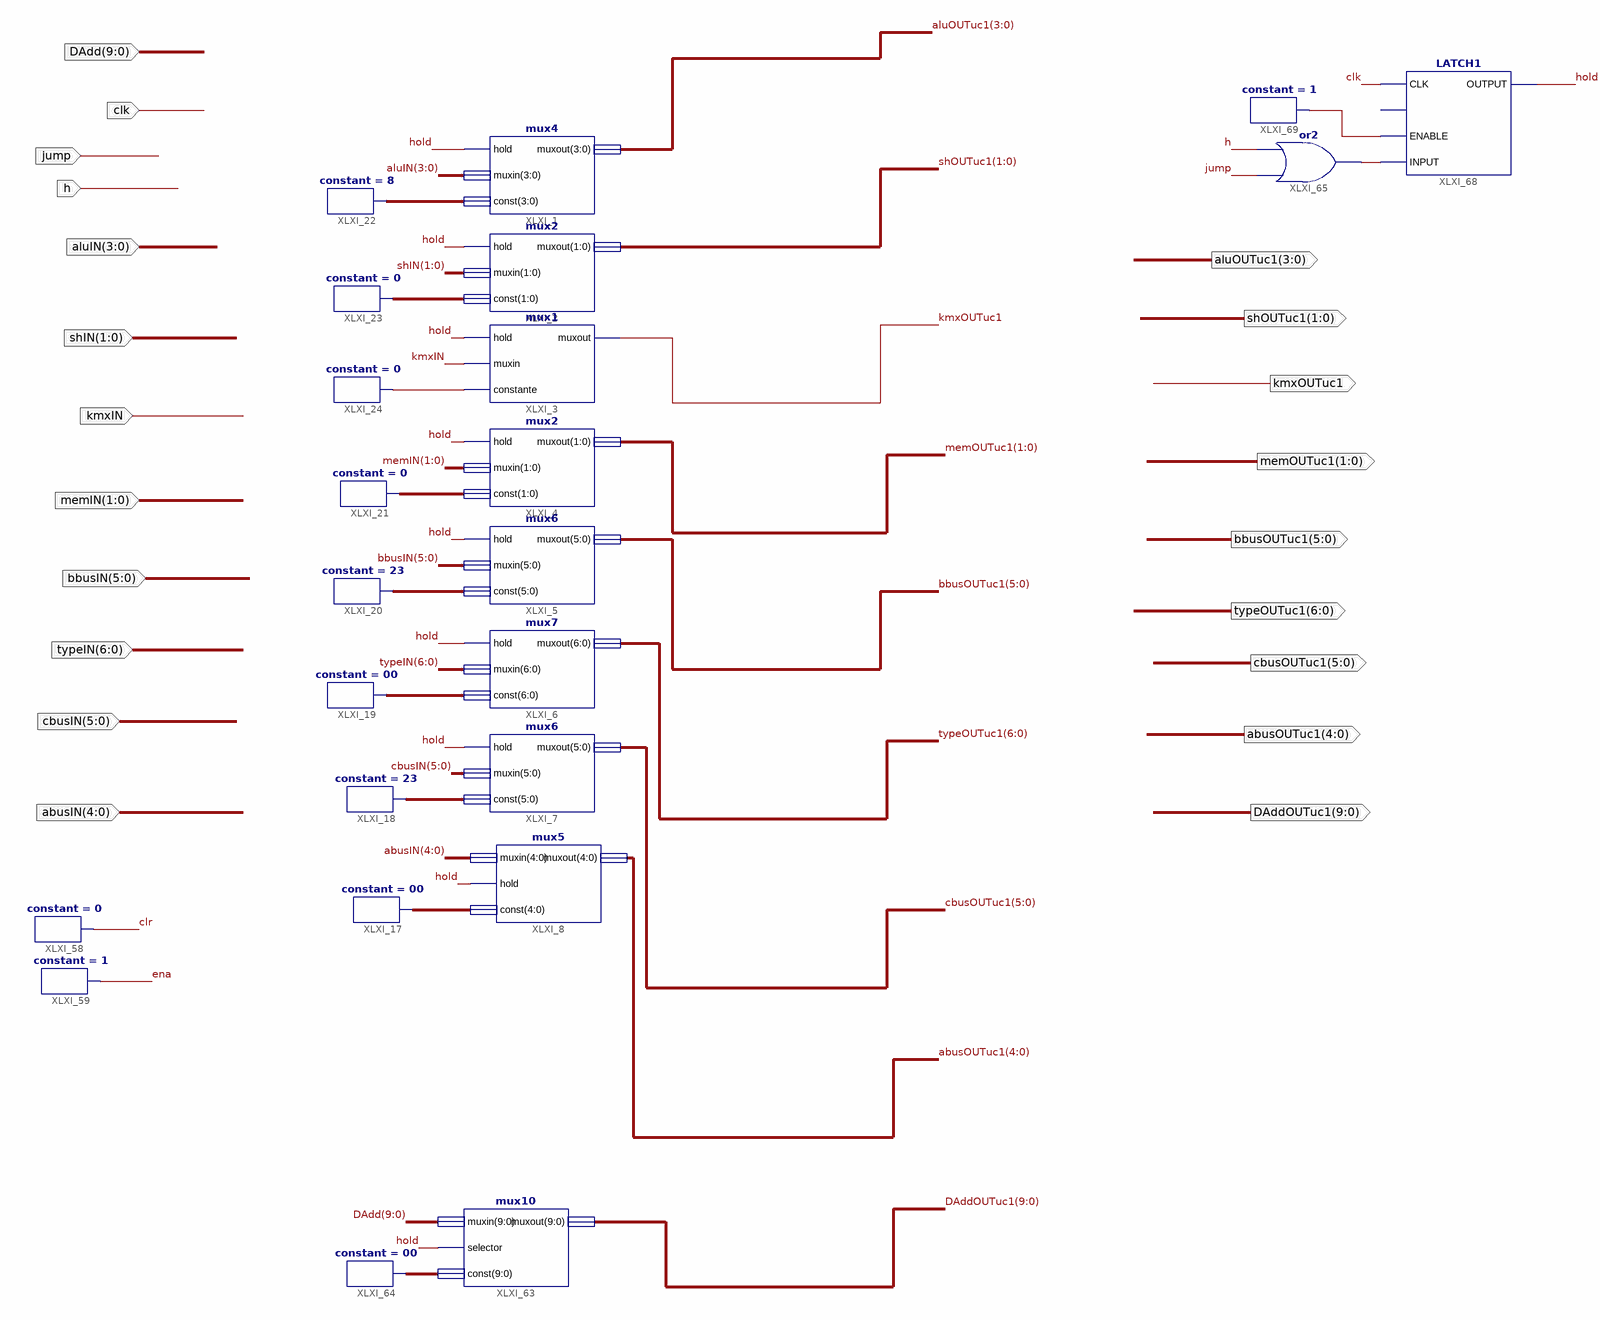
[diagram p0: schematic sheet 1]
// Xilinx ISE schematic UC1.sch (artix7) as structural Verilog: 23 symbols, 21 ports
module UC1 (
  input  [3:0] aluIN,
  input  [1:0] shIN,
  input  kmxIN,
  input  [1:0] memIN,
  input  [5:0] bbusIN,
  input  [6:0] typeIN,
  input  [5:0] cbusIN,
  input  [4:0] abusIN,
  input  clk,
  input  [9:0] DAdd,
  input  jump,
  input  h,
  output [3:0] aluOUTuc1,
  output [1:0] shOUTuc1,
  output kmxOUTuc1,
  output [1:0] memOUTuc1,
  output [5:0] bbusOUTuc1,
  output [6:0] typeOUTuc1,
  output [5:0] cbusOUTuc1,
  output [4:0] abusOUTuc1,
  output [9:0] DAddOUTuc1
);

  wire clr, ena, hold, XLXN_26, XLXN_161, XLXN_162;
  wire [1:0] XLXN_23, XLXN_29;
  wire [3:0] XLXN_20;
  wire [4:0] XLXN_42;
  wire [5:0] XLXN_33, XLXN_39;
  wire [6:0] XLXN_36;
  wire [9:0] XLXN_151;

  mux4 XLXI_1 (.hold(hold), .muxin(aluIN), .\const (XLXN_20), .muxout(aluOUTuc1));
  mux2 XLXI_2 (.hold(hold), .muxin(shIN), .\const (XLXN_23), .muxout(shOUTuc1));
  mux1 XLXI_3 (.hold(hold), .muxin(kmxIN), .constante(XLXN_26), .muxout(kmxOUTuc1));
  mux2 XLXI_4 (.hold(hold), .muxin(memIN), .\const (XLXN_29), .muxout(memOUTuc1));
  mux6 XLXI_5 (.hold(hold), .muxin(bbusIN), .\const (XLXN_33), .muxout(bbusOUTuc1));
  mux7 XLXI_6 (.hold(hold), .muxin(typeIN), .\const (XLXN_36), .muxout(typeOUTuc1));
  mux6 XLXI_7 (.hold(hold), .muxin(cbusIN), .\const (XLXN_39), .muxout(cbusOUTuc1));
  mux5 XLXI_8 (.muxin(abusIN), .hold(hold), .\const (XLXN_42), .muxout(abusOUTuc1));
  constant #(.CValue("00")) XLXI_17 (.O(XLXN_42));
  constant #(.CValue("23")) XLXI_18 (.O(XLXN_39));
  constant #(.CValue("00")) XLXI_19 (.O(XLXN_36));
  constant #(.CValue("23")) XLXI_20 (.O(XLXN_33));
  constant #(.CValue("0")) XLXI_21 (.O(XLXN_29));
  constant #(.CValue("8")) XLXI_22 (.O(XLXN_20));
  constant #(.CValue("0")) XLXI_23 (.O(XLXN_23));
  constant #(.CValue("0")) XLXI_24 (.O(XLXN_26));
  constant #(.CValue("0")) XLXI_58 (.O(clr));
  constant #(.CValue("1")) XLXI_59 (.O(ena));
  mux10 XLXI_63 (.muxin(DAdd), .selector(hold), .\const (XLXN_151), .muxout(DAddOUTuc1));
  constant #(.CValue("00")) XLXI_64 (.O(XLXN_151));
  LATCH1 XLXI_68 (.CLK(clk), .ENABLE(XLXN_162), .INPUT(XLXN_161), .OUTPUT(hold));  // open: CLR
  constant #(.CValue("1")) XLXI_69 (.O(XLXN_162));
  or XLXI_65 (XLXN_161, jump, h);
endmodule
